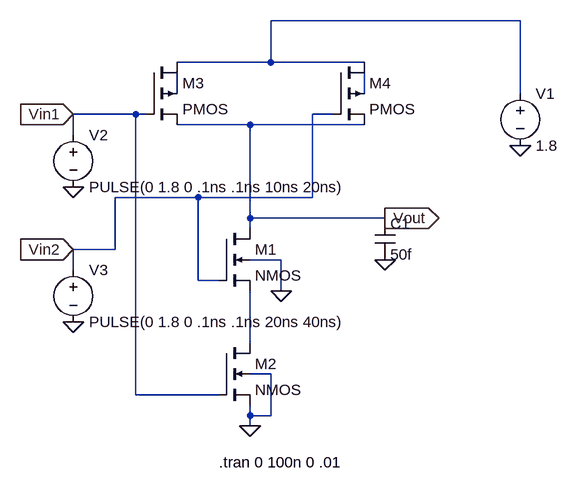
[diagram p0: schematic NAND.asc]
NAND.asc, the LTspice schematic file:
Version 4
SHEET 1 880 680
WIRE 624 -176 240 -176
WIRE 240 -112 240 -176
WIRE 240 -112 96 -112
WIRE 384 -112 240 -112
WIRE 96 -64 96 -96
WIRE 384 -64 384 -96
WIRE 624 -64 624 -176
WIRE 32 -32 -64 -32
WIRE 48 -32 32 -32
WIRE 336 -32 304 -32
WIRE 208 -16 96 -16
WIRE 384 -16 208 -16
WIRE -64 0 -64 -32
WIRE 128 96 0 96
WIRE 304 96 304 -32
WIRE 304 96 128 96
WIRE 208 128 208 -16
WIRE 416 128 208 128
WIRE 208 144 208 128
WIRE 0 176 0 96
WIRE 0 176 -64 176
WIRE 256 192 208 192
WIRE -64 208 -64 176
WIRE 128 224 128 96
WIRE 160 224 128 224
WIRE 256 240 256 192
WIRE 208 320 208 240
WIRE 240 368 208 368
WIRE 32 400 32 -32
WIRE 160 400 32 400
WIRE 208 432 208 416
WIRE 240 432 240 368
WIRE 240 432 208 432
WIRE 208 448 208 432
FLAG 208 448 0
FLAG 256 240 0
FLAG 624 16 0
FLAG -64 288 0
FLAG -64 80 0
FLAG 416 192 0
FLAG 416 128 Vout
IOPIN 416 128 Out
FLAG -64 -32 Vin1
IOPIN -64 -32 In
FLAG -64 176 Vin2
IOPIN -64 176 In
SYMBOL nmos4 160 144 R0
SYMATTR InstName M1
SYMATTR Value2 l=180nm w=270nm
SYMBOL nmos4 160 320 R0
SYMATTR InstName M2
SYMATTR Value2 l=180nm w=270nm
SYMBOL pmos4 48 -112 R0
SYMATTR InstName M3
SYMATTR Value2 l=180nm w=810nm
SYMBOL pmos4 336 -112 R0
SYMATTR InstName M4
SYMATTR Value2 l=180nm w=810nm
SYMBOL voltage 624 -80 R0
WINDOW 123 0 0 Left 0
WINDOW 39 0 0 Left 0
SYMATTR InstName V1
SYMATTR Value 1.8
SYMBOL voltage -64 -16 R0
WINDOW 123 0 0 Left 0
WINDOW 39 0 0 Left 0
SYMATTR InstName V2
SYMATTR Value PULSE(0 1.8 0 .1ns .1ns 10ns 20ns)
SYMBOL voltage -64 192 R0
WINDOW 123 0 0 Left 0
WINDOW 39 0 0 Left 0
SYMATTR InstName V3
SYMATTR Value PULSE(0 1.8 0 .1ns .1ns 20ns 40ns)
SYMBOL cap 400 128 R0
SYMATTR InstName C1
SYMATTR Value 50f
TEXT 160 504 Left 2 !.tran 0 100n 0 .01

The netlist it stands for:
* NAND.asc
M1 Vout Vin2 N004 0 NMOS l=180nm w=270nm
M2 N004 Vin1 0 0 NMOS l=180nm w=270nm
M3 N001 Vin1 Vout N002 PMOS l=180nm w=810nm
M4 N001 Vin2 Vout N003 PMOS l=180nm w=810nm
V1 N001 0 1.8
V2 Vin1 0 PULSE(0 1.8 0 .1ns .1ns 10ns 20ns)
V3 Vin2 0 PULSE(0 1.8 0 .1ns .1ns 20ns 40ns)
C1 Vout 0 50f
.model NMOS NMOS
.model PMOS PMOS
.lib standard.mos
.tran 0 100n 0 .01
.backanno
.end